# EasyEDA Pro project ProPrj_HTXStudio_OneHanded_Keyboard.epro, board TypeC
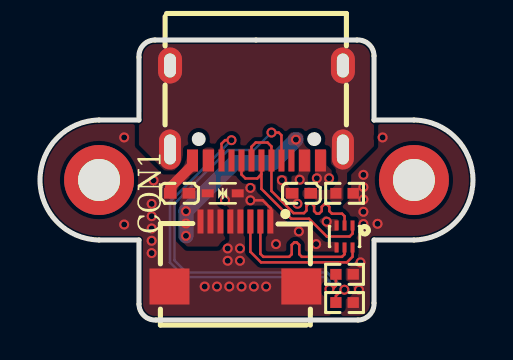
[diagram p14: board, top side]
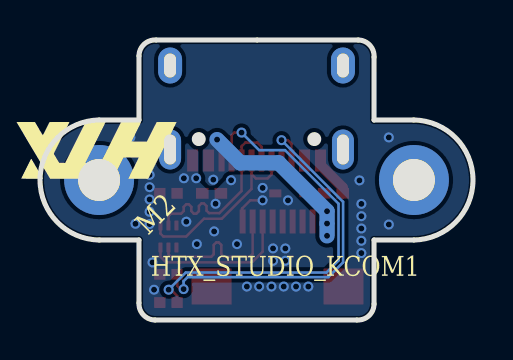
[diagram p15: board, bottom side, seen from below]

Outline 21.67 x 14 mm; copper layers: Top Layer, Bottom Layer. Coordinates in mm from the lower left corner of the outline.
Outline path: 2.96,4 arc(0,7) 2.96,10 4.95,10 4.95,13.14 arc(5.17,13.74) 5.75,14 15.86,14 arc(16.46,13.79) 16.72,13.2 16.72,10 18.71,10 arc(21.67,7) 18.7,4 16.72,4 16.72,0.86 arc(16.5,0.26) 15.91,0 5.81,0 arc(5.21,0.21) 4.95,0.8 4.95,4 2.96,4
Stack: Top Layer 0.035mm / Dielectric1 1.51mm FR4 er 4.5 / Bottom Layer 0.035mm

## Design rules (mm)
net USB_DP: DP2
net USB_DM: DP2
net USB_DM_FPC: DP1
net USB_DP_FPC: DP1
template: 自定义配置
spacing copperThickness1oz (default): track to track 0.102, other pairs 0.05 to 0.3
spacing copperThickness2oz: track to track 0.203, other pairs 0.152 to 0.3
track width copperThickness1oz (default): min 0.127, default 0.254, max 2.54
track width copperThickness2oz: min 0.203, default 0.254, max 2.54
differential pair differentialPair (default): width min 0.127, default 0.254, max 2.54; gap min 0.152, default 0.152
via viaSize (default): diameter min 0.4, default 0.4, max 10; hole min 0.3, default 0.3, max 6.3

## Placement (name value [footprint] x y rotation side)
C1  1uF  [C0402]  6.99 6.33 0 top
C2  100nF  [C0402]  13.08 6.33 0 top
D2  LESD5Z5.0CT1G  [SOD-523_L1.2-W0.8-LS1.6-BI]  9.14 6.33 0 top
FPC10  FPC-05FB-8PH20  [FPC-SMD_8P-P0.50_XUNPU_FPC-05FB-8PH20]  9.78 3.3 0 top
L1  3Ω  [TDFN-6_L1.4-W1.2-P0.40-BL]  15.24 4.17 180 top
NOREF  -  [Pad_e31]  2.96 7 0 top
NOREF#2  -  [Pad_e93]  18.71 7 0 top
R6  5.1kΩ  [R0402]  15.24 0.87 180 top
R7  5.1kΩ  [R0402]  15.24 2.28 180 top
R9  47Ω  [R0402]  15.24 6.33 180 top
USB1  TYPE-C 16PIN 2MD(073)  [USB-C-SMD_TYPE-C-6PIN-2MD-073]  10.83 10.35 180 top

## Footprints (pads in the part's own frame, mm; a bottom-side part is the same pattern mirrored in y, then rotated)
C0402
  rect 0.63x0.54 smd: 1(-0.465,0) 2(0.465,0)
FPC-SMD_8P-P0.50_XUNPU_FPC-05FB-8PH20
  rect 0.3x1.2 smd: 1(1.75,1.625) 2(1.25,1.625) 3(0.75,1.625) 4(0.25,1.625) 5(-0.25,1.625) 6(-0.75,1.625) 7(-1.25,1.625) 8(-1.75,1.625)
  rect 2x1.8 smd: 9(-3.3,-1.625) 10(3.3,-1.625)
Pad_e31
  round 3.5 hole 2.1: 1(0,0)
Pad_e93
  round 3.5 hole 2.1: 1(0,0)
R0402
  rect 0.566x0.54 smd: 1(-0.433,0) 2(0.433,0)
SOD-523_L1.2-W0.8-LS1.6-BI
  rect 0.6x0.4 smd: 1(-0.75,0) 2(0.75,0)
TDFN-6_L1.4-W1.2-P0.40-BL
  rect 0.2x0.5 smd: 1(-0.4,-0.55) 2(0,-0.55) 3(0.4,-0.55) 4(0.4,0.55) 5(0,0.55) 6(-0.4,0.55)
USB-C-SMD_TYPE-C-6PIN-2MD-073
  rect 0.55x1.1 smd: 1(-3.2,2.375) 2(-2.4,2.375) 11(2.4,2.375) 12(3.2,2.375)
  rect 0.3x1.1 smd: 3(-1.75,2.375) 4(-1.25,2.375) 5(-0.75,2.375) 6(-0.25,2.375) 7(0.25,2.375) 8(0.75,2.375) 9(1.25,2.375) 10(1.75,2.375)
  oval 1.1x2 hole 0.6x1.5: 13(-4.325,1.825) 14(4.325,1.825)
  oval 1.2x1.8 hole 0.6x1.2: 13(-4.325,-2.375) 14(4.325,-2.375)

## Nets
As in the schematic.

Pads without a net: NOREF 1; NOREF#2 1; USB1 3 9

## Via types
v1: diameter 0.5, hole 0.3, Top Layer to Bottom Layer, 47 vias

## Routing (per net, layer and track width the routed paths; a pad name or vN(x,y) marks a point on that pad's centre or on a via; arc(x,y) is an arc through that point)
GND: length 4
  Top Layer w0.127: FPC10.1 11.56,4.95 11.56,5.57 11.15,5.98 v1(10.53,5.98)
  Top Layer w0.508: C1.1 6.52,6.63 7.63,7.74 USB1.12
  vias: v1(4.21,9.13) v1(4.21,4.77) v1(5.59,5.81) v1(5.59,5.19) v1(5.59,4.58) v1(5.59,3.96) v1(5.59,3.35) v1(5.68,6.98) v1(8.24,1.67) v1(8.86,1.67) v1(9.26,5.98) v1(9.39,3.58) v1(9.39,2.96) v1(9.47,1.67) v1(10.01,3.58) v1(10.01,2.96) v1(10.09,1.67) v1(10.53,6.6) v1(10.7,1.67) v1(11.32,1.67) v1(11.81,3.79) v1(12.11,6.99) v1(12.88,5.81) v1(12.95,4.43) v1(13.85,7.09) v1(13.82,3.79) v1(14.35,4.92) v1(14.47,7.09) v1(15.96,1.52) v1(16.04,2.88) v1(16.18,7.26) v1(16.18,6.64) v1(16.18,6.03) v1(16.18,5.41) v1(16.18,4.8) v1(16.89,4.81) v1(17.15,9.13)
VBUS: length 8.2
  Bottom Layer w0.762: v1(12.81,9.02) 11.65,7.86 9.72,7.86 v1(7.31,5.44) v1(7.31,4.82) v1(7.31,4.21)
  vias: v1(13,7.02)
USB_DM: length 9.6
  Top Layer w0.127: USB1.7 10.58,8.66 10.8,8.87 11.39,8.87 11.58,8.68 11.58,8.44 ; USB1.5 11.58,6.45 12.69,5.34 13.21,5.34 13.34,5.47 13.34,5.7 13.46,5.83 13.59,5.83 13.72,5.7 13.72,5.45 13.84,5.32 13.97,5.32 14.1,5.45 14.1,5.66 14.22,5.78 14.35,5.78 14.48,5.66 14.48,5.45 14.61,5.32 15.11,5.32 15.24,5.19 15.24,4.73
USB_DM_FPC: length 7.4
  Top Layer w0.127: L1.5 15.24,3.29 15.11,3.16 13.1,3.16 12.98,3.29 12.98,3.75 12.85,3.88 12.72,3.88 12.59,3.75 12.59,3.29 12.47,3.16 11.18,3.16 11.03,3.31 FPC10.2
USB_DP: length 9.4
  Top Layer w0.127: USB1.6 11.08,6.55 12.57,5.06 13.46,5.06 14.35,4.17 15.49,4.17 15.64,4.32 15.64,4.78 ; 11.08,7.29 10.87,7.08 10.28,7.08 10.08,7.27 USB1.8
USB_DP_FPC: length 7.4
  Top Layer w0.127: L1.6 15.64,3.16 15.36,2.88 11.06,2.88 10.53,3.41 FPC10.3
$1N2982: length 21
  Top Layer w0.127: v1(15.23,1.52) 15.12,1.52 14.81,1.2 R6.2 ; v1(11.58,9.37) 11.95,9.37 12.08,9.24 USB1.4
  Bottom Layer w0.127: 15.23,1.52 14.38,2.37 7.33,2.37 6.73,2.98 6.73,5.82 9.41,8.49 10.7,8.49 v1(11.58,9.37)
$1N2983: length 18.4
  Top Layer w0.127: 14.81,2.16 14.81,1.71 14.64,1.55 v1(14.48,1.55) ; v1(9.58,8.99) 9.26,8.99 9.08,8.81 USB1.10
  Bottom Layer w0.127: v1(9.58,8.99) 6.5,5.91 6.5,2.88 7.24,2.14 14.28,2.14 14.48,1.94 v1(14.48,1.55)

## Copper pours and planes (outline as drawn; the poured copper is in the pictures)
GND on Top Layer: 15.91,0 16.5,0.26 16.72,0.86 16.72,4 18.7,4 21.67,7 18.71,10 16.72,10 16.72,13.2 16.46,13.79 15.86,14 5.75,14 5.17,13.74 4.95,13.14 4.95,10 2.96,10 0,7 2.96,4 4.95,4 4.95,0.8 5.21,0.21 5.81,0
GND on Top Layer: 13.73,8.53 13.73,7.37 13.59,7.22 13.59,6.84 13.72,6.72 14.47,6.72 14.6,6.84 14.6,7.48 14.35,7.73 14.35,8.53
GND on Bottom Layer: 15.91,0 16.5,0.26 16.72,0.86 16.72,4 18.7,4 21.67,7 18.71,10 16.72,10 16.72,13.2 16.46,13.79 15.86,14 5.75,14 5.17,13.74 4.95,13.14 4.95,10 2.96,10 0,7 2.96,4 4.95,4 4.95,0.8 5.21,0.21 5.81,0
VBUS on Top Layer: 12.42,8.69 12.58,8.53 12.58,6.83 12.7,6.72 13.2,6.72 13.57,7.09 13.57,8.85 13.04,9.38 12.57,9.38 12.42,9.23
VBUS on Top Layer: 8,7.35 6.99,6.33 6.99,4.05 7.37,3.67 8.89,3.67 9.27,4.05 9.27,5.49 8.82,5.94 8.82,8.44 8.64,8.62 8.13,8.62 8,8.49
VBUS on Bottom Layer: 11.58,7.48 12.19,7.48 12.95,6.72 13.21,6.72 13.53,7.04 13.53,8.8 13.08,9.26 12.7,9.26 11.58,8.14
$1N13714 on Top Layer: 4.95,8.75 6.22,7.48 12.57,7.48 13.08,6.97 13.08,6.08 13.34,5.83 14.98,5.83 15.37,6.21 15.37,7.35 16.72,8.7 16.72,13.53 16.24,14 5.42,14 4.95,13.53

Small or netless copper shapes (teardrops, artwork), in the pictures only: 10 on Top Layer, 2 on Bottom Layer

## Text on the board
Bottom Silkscreen Layer: HTX_STUDIO_KCOM1 | M2
Top Silkscreen Layer: CON1
